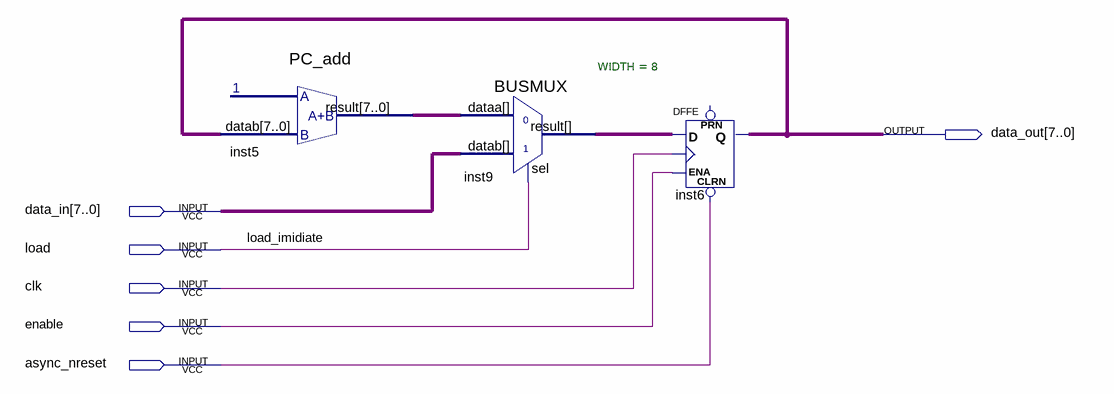
[diagram p0: schematic sheet]
// Quartus schematic wb_cpu_programcounter.bdf as structural Verilog: 3 symbols, 6 pins
module wb_cpu_programcounter (
  input  [7:0] data_in,
  input  load,
  input  clk,
  input  enable,
  input  async_nreset,
  output [7:0] data_out
);

  wire [7:0] inst5_result, inst9_result;

  PC_add inst5 (.datab(data_out), .result(inst5_result));
  BUSMUX #(.WIDTH(8)) inst9 (.datab(data_in), .sel(load), .dataa(inst5_result), .result(inst9_result));
  DFFE inst6[7:0] (.CLRN(async_nreset), .D(inst9_result), .CLK(clk), .ENA(enable), .Q(data_out));  // open: PRN

  // Other names for the same wires on the sheet: load_imidiate = load
endmodule
